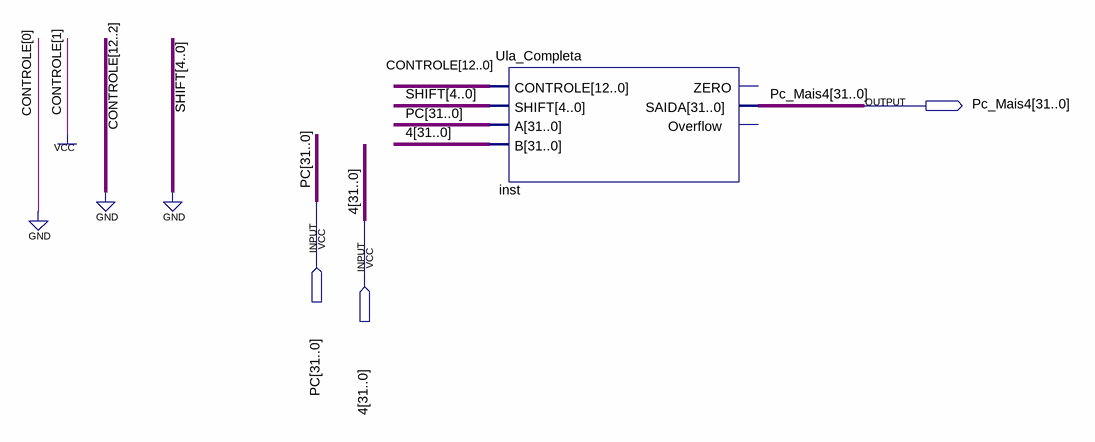
[diagram p0: schematic sheet]
// Quartus schematic Add_Pc.bdf as structural Verilog: 1 symbols, 3 pins
module Add_Pc (
  input  [31:0] PC,
  input  [31:0] \4 ,
  output [31:0] Pc_Mais4
);

  Ula_Completa inst (
    .CONTROLE(13'b0000000000010), .SHIFT({5{1'b0}}), .A(PC), .B(\4 ), .SAIDA(Pc_Mais4));  // open: ZERO, Overflow
endmodule
